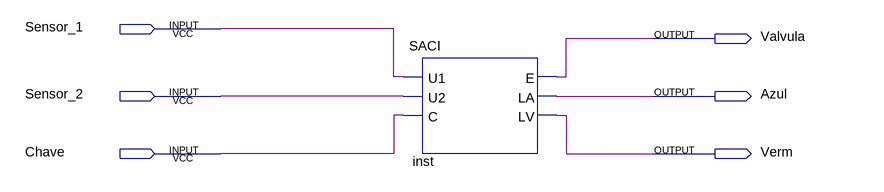
[diagram p0: schematic sheet]
// Quartus schematic Esquematico_01.bdf as structural Verilog: 1 symbols, 6 pins
module Esquematico_01 (
  input  Sensor_1,
  input  Sensor_2,
  input  Chave,
  output Valvula,
  output Azul,
  output Verm
);

  SACI inst (.U1(Sensor_1), .U2(Sensor_2), .C(Chave), .E(Valvula), .LA(Azul), .LV(Verm));
endmodule
